# Altium project Placa_Base_ADA.PrjPcb
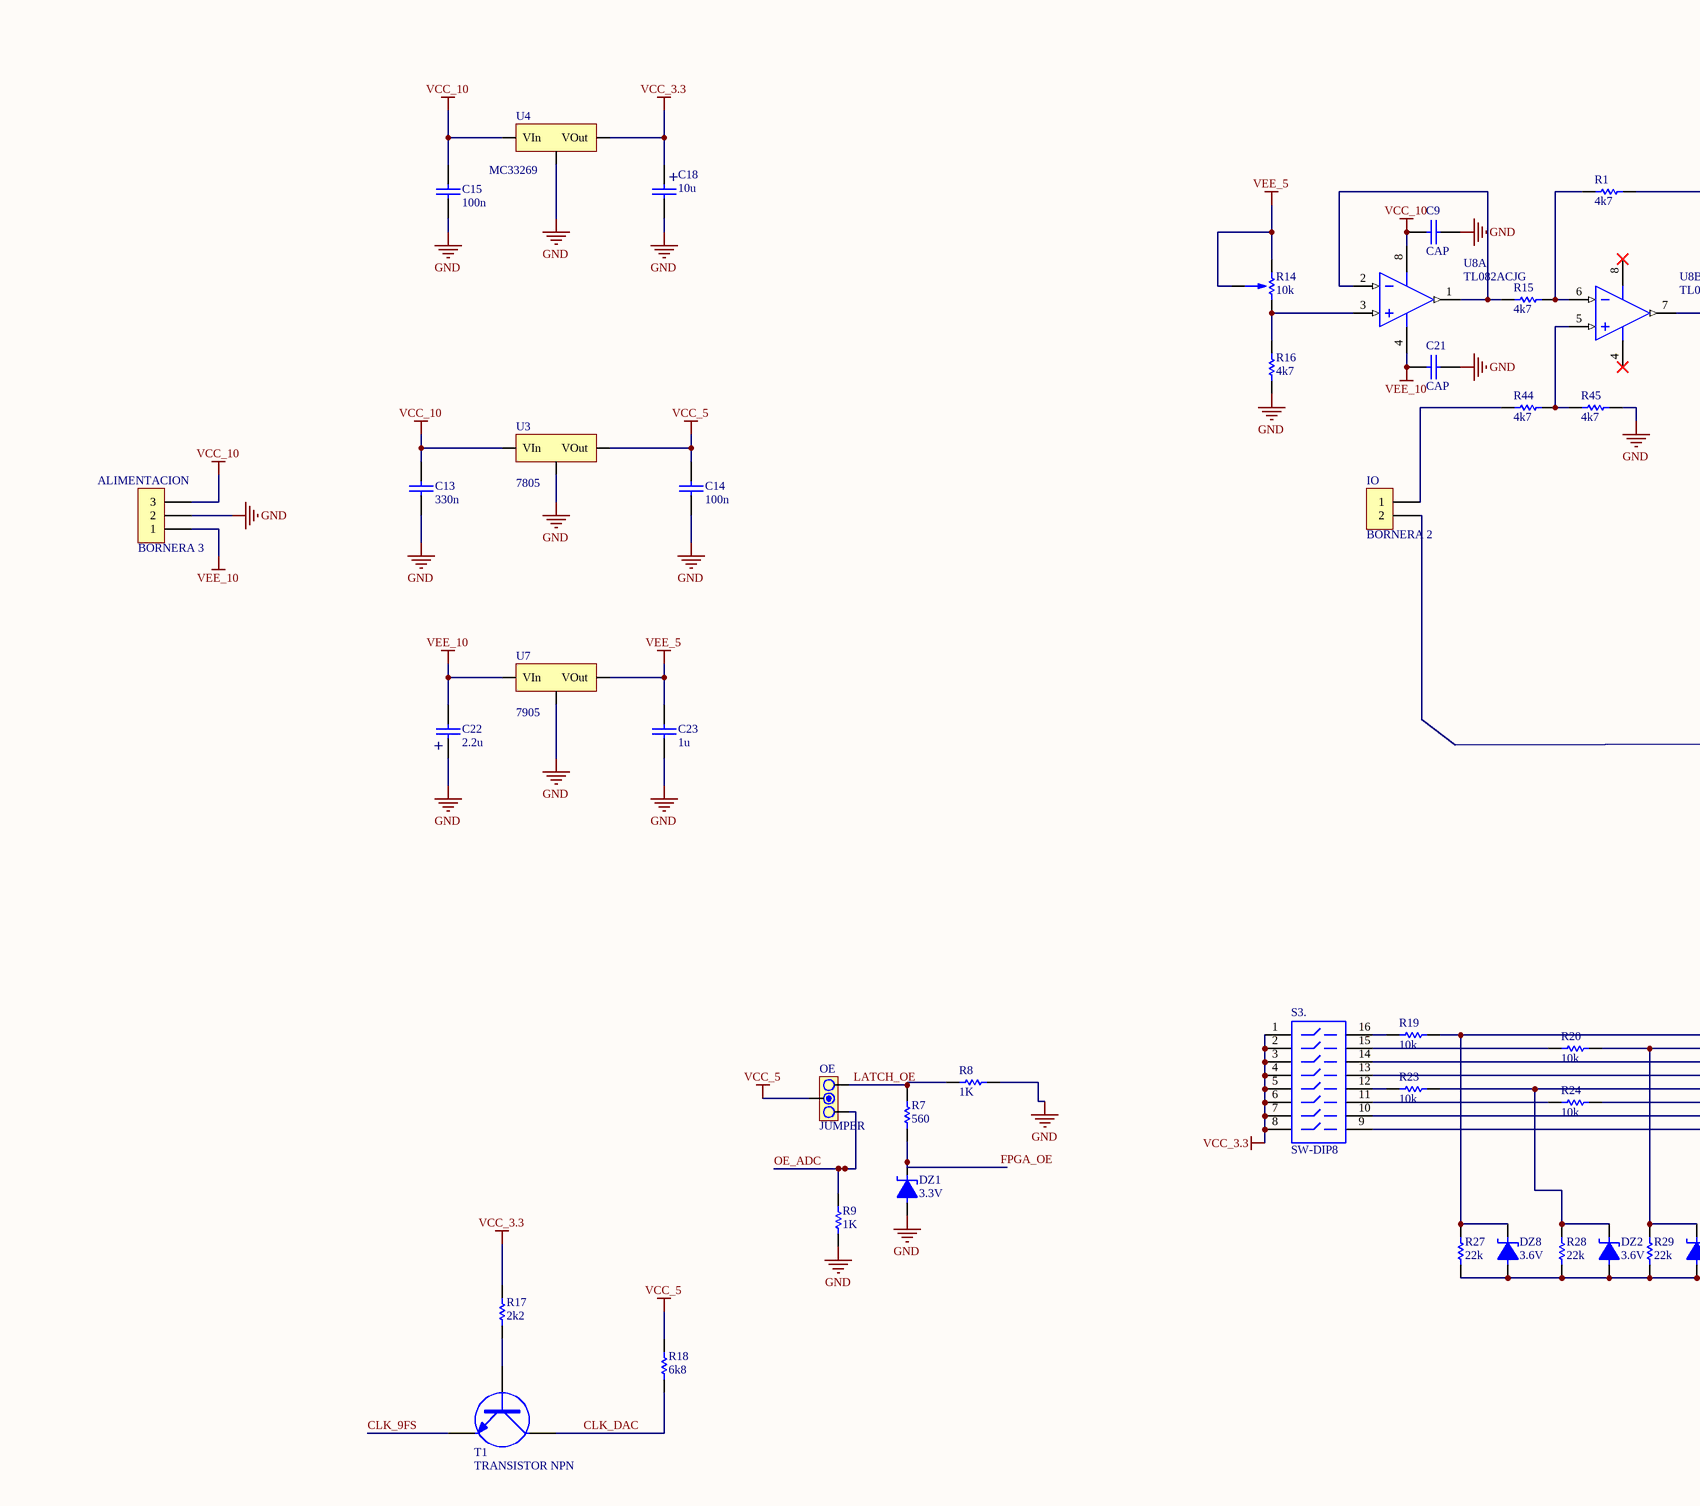
[diagram p0: Placa_Base.SchDoc, top left]
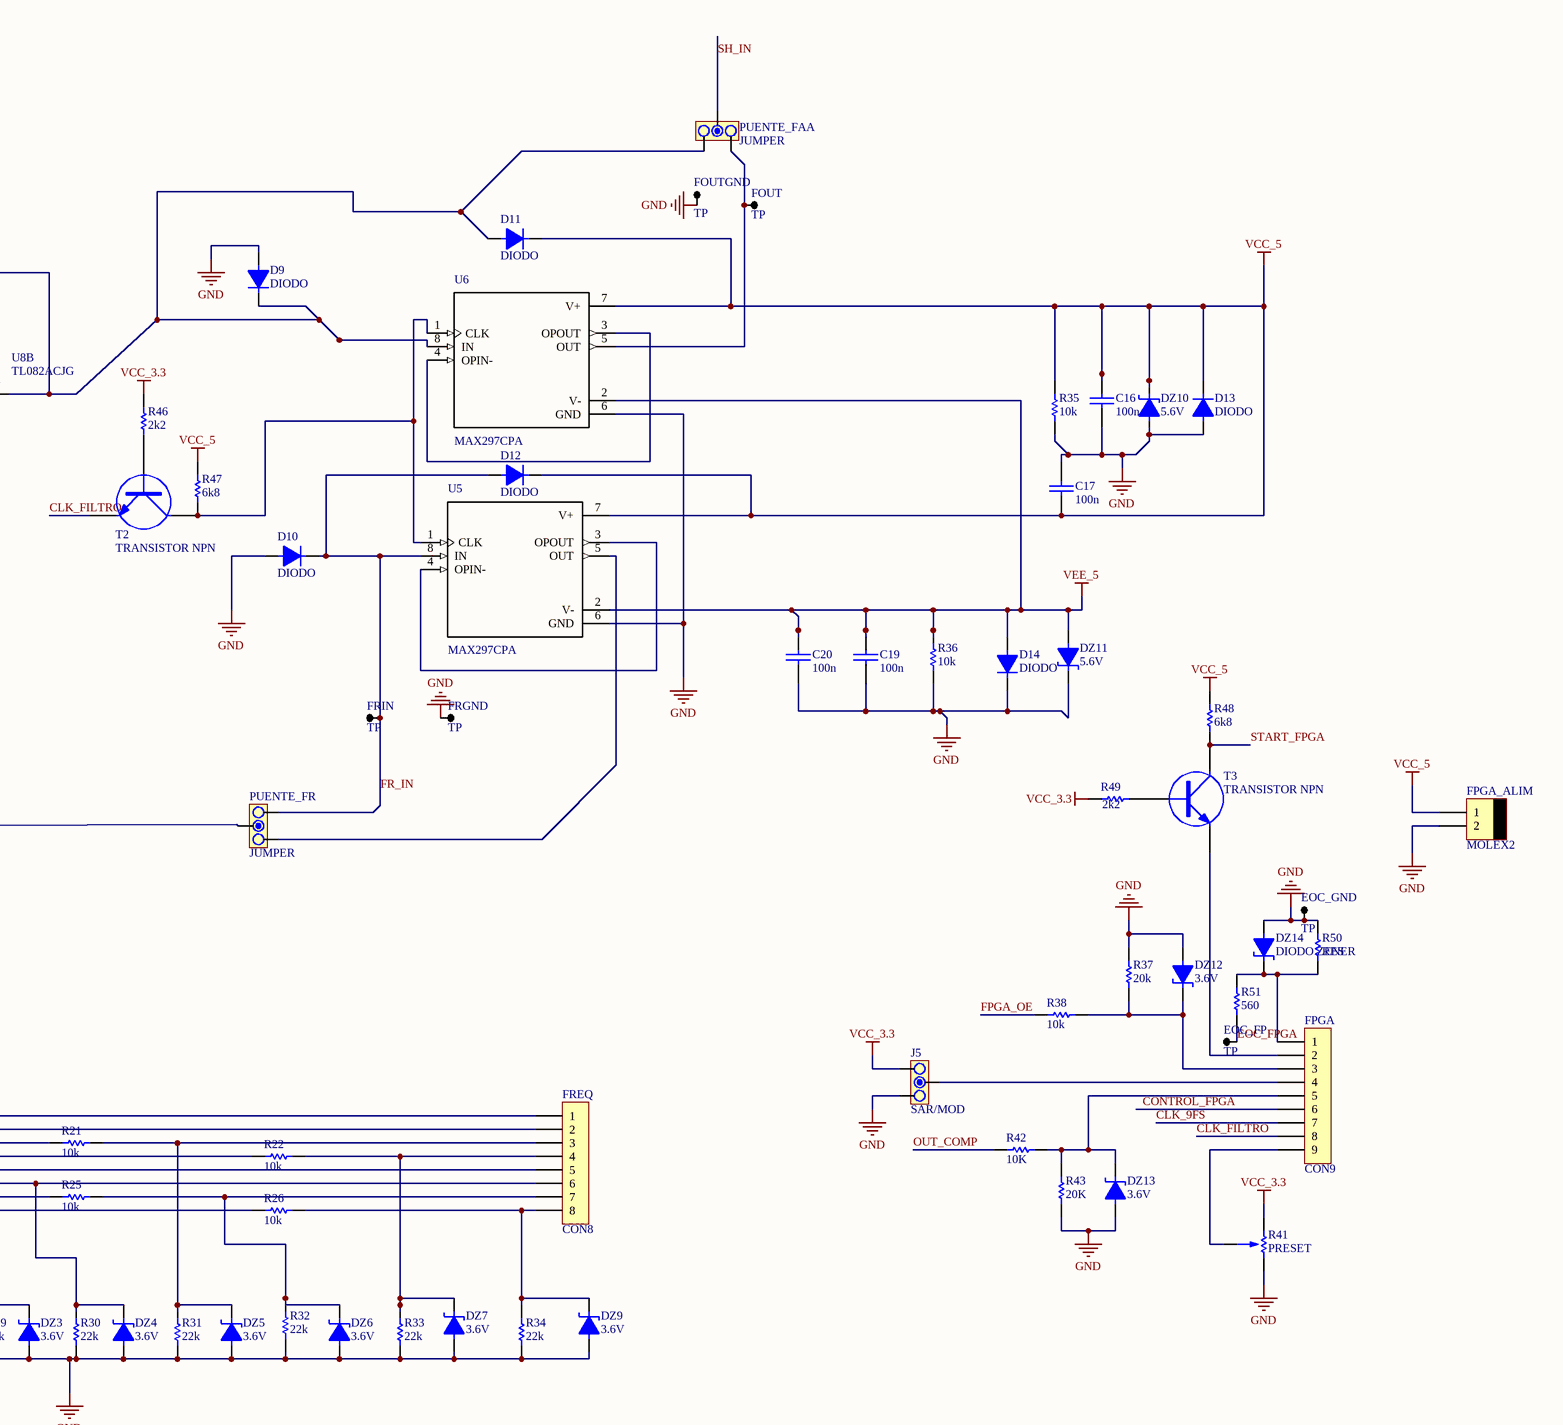
[diagram p1: Placa_Base.SchDoc, top right]
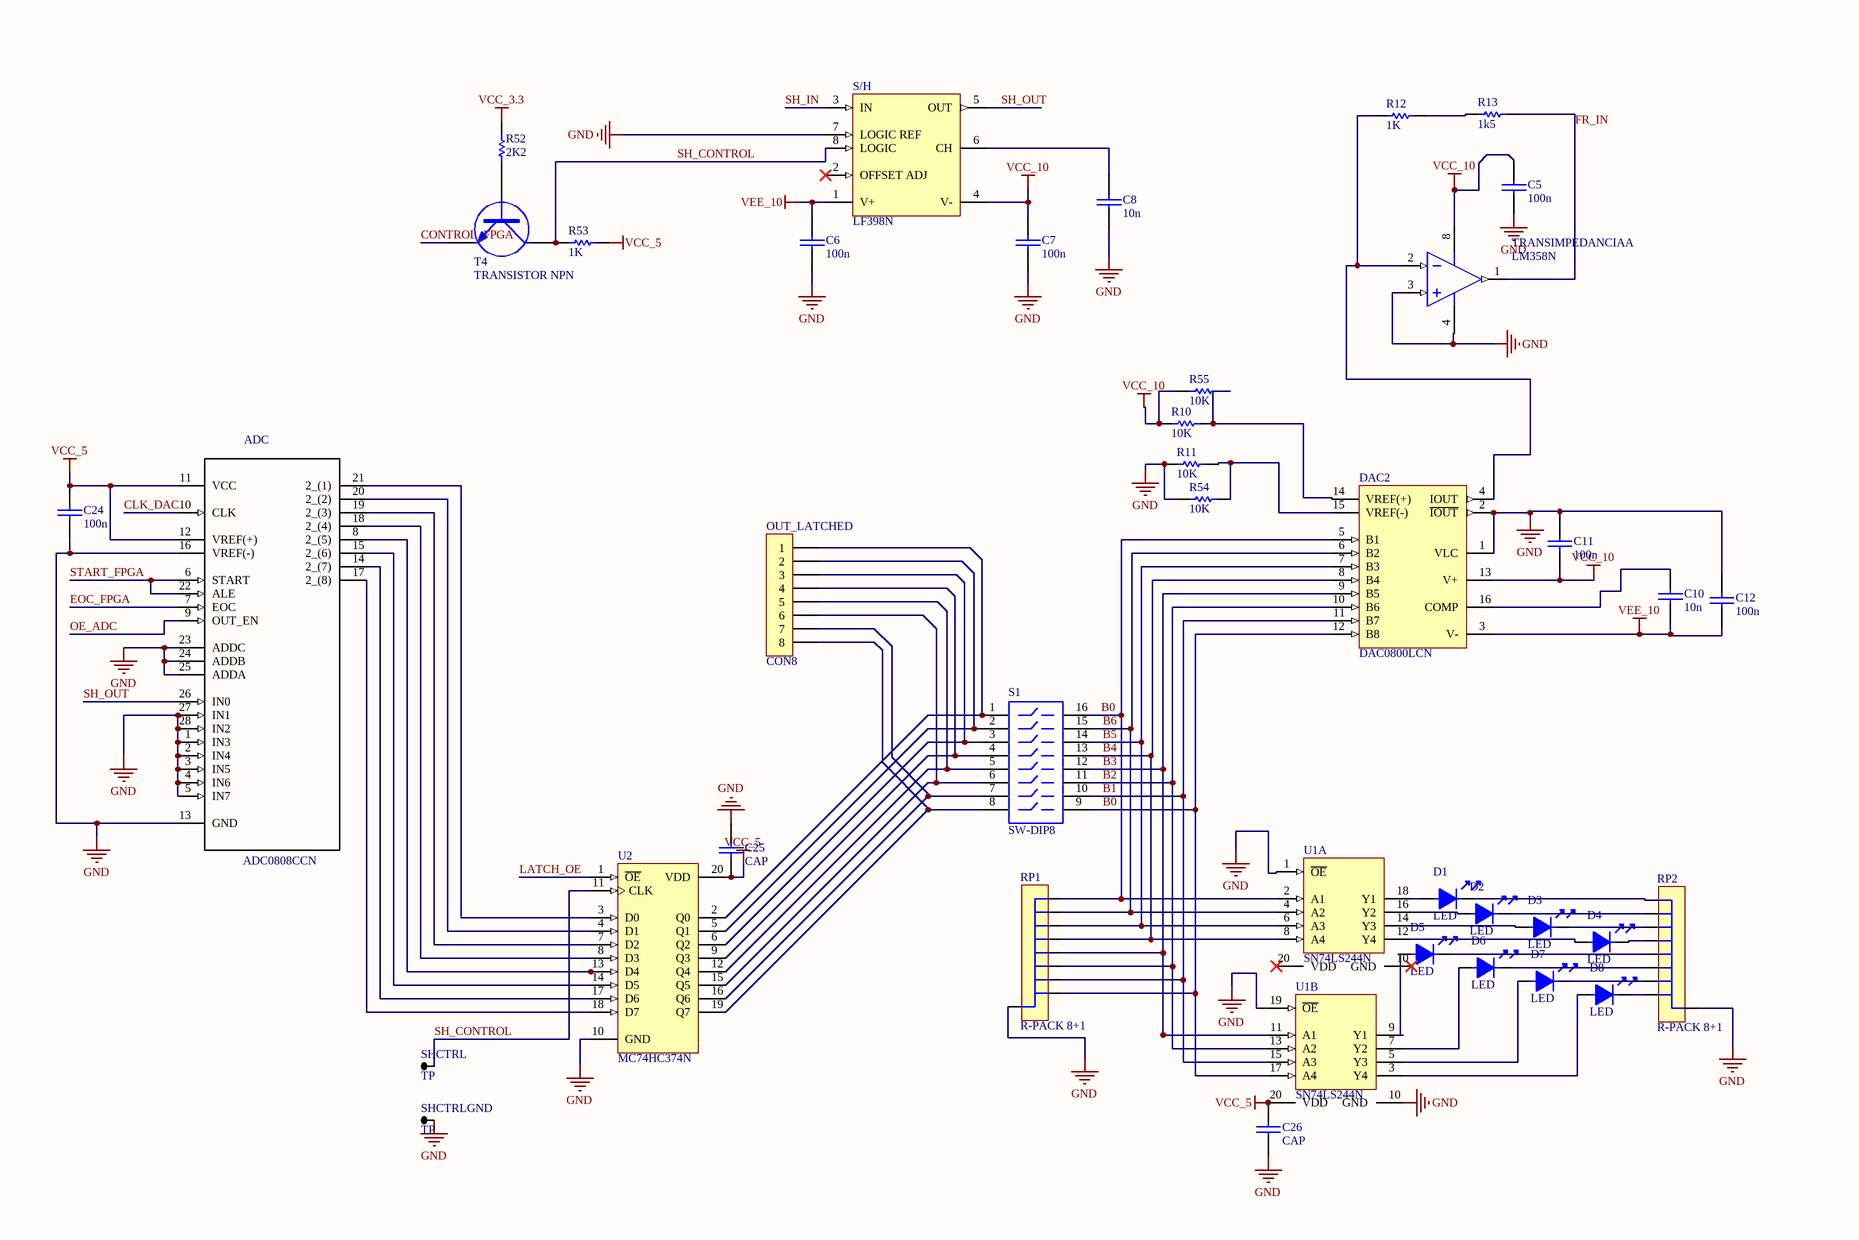
[diagram p2: Placa_Base.SchDoc, bottom left]
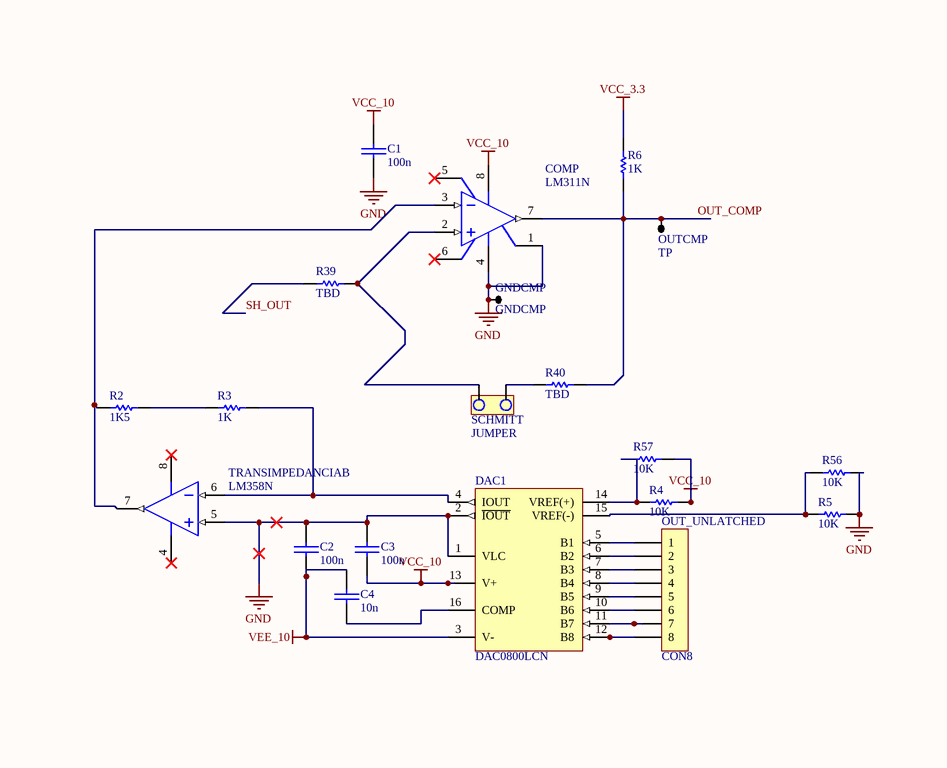
[diagram p3: Placa_Base.SchDoc, bottom right]
1 sheet, 155 parts. Net scope: global (net labels, ports and power ports of the same name join across sheets).
Board file: PCB5.PcbDoc

## Sheet Placa_Base.SchDoc
size A0

### Parts
ADC  ADC0808CCN  [DIP28]
ALIMENTACION  BORNERA 3  [BORNERA3]
C1  100n  [CAP200]
C2  100n  [CAP200]
C3  100n  [CAP200]
C4  10n  [CAP200]
C5  100n  [CAP200]
C6  100n  [CAP200]
C7  100n  [CAP200]
C8  10n  [CAP200]
C9  CAP  [CAP200]
C10  10n  [CAP200]
C11  100n  [CAP200]
C12  100n  [CAP200]
C13  330n  [CAP200]
C14  100n  [CAP200]
C15  100n  [CAP200]
C16  100n  [CAP200]
C17  100n  [CAP200]
C18  10u  [CAP100RP]
C19  100n  [CAP200]
C20  100n  [CAP200]
C21  CAP  [CAP200]
C22  2.2u  [CAP100RP]
C23  1u  [CAP200]
C24  100n  [CAP200]
C25  CAP  [CAP200]
C26  CAP  [CAP200]
COMP  LM311N  [N08E]
D1  LED  [LED3]
D2  LED  [LED3]
D3  LED  [LED3]
D4  LED  [LED3]
D5  LED  [LED3]
D6  LED  [LED3]
D7  LED  [LED3]
D8  LED  [LED3]
D9  DIODO  [DO41]
D10  DIODO  [DO41]
D11  DIODO  [DO41]
D12  DIODO  [DO41]
D13  DIODO  [DO41]
D14  DIODO  [DO41]
DAC1  DAC0800LCN  [N16E]
DAC2  DAC0800LCN  [N16E]
DZ1  3.3V  [DO41]
DZ2  3.6V  [DO41]
DZ3  3.6V  [DO41]
DZ4  3.6V  [DO41]
DZ5  3.6V  [DO41]
DZ6  3.6V  [DO41]
DZ7  3.6V  [DO41]
DZ8  3.6V  [DO41]
DZ9  3.6V  [DO41]
DZ10  5.6V  [DO41]
DZ11  5.6V  [DO41]
DZ12  3.6V  [DO41]
DZ13  3.6V  [DO41]
DZ14  DIODO ZENER  [DO41]
EOC_FP  TP  [TPTH]
EOC_GND  TP  [TPTH]
FOUT  TP  [TPTH]
FOUTGND  TP  [TPTH]
FPGA  CON9  [SIP9]
FPGA_ALIM  MOLEX2  [MOLEX2]
FREQ  CON8  [SIP8]
FRGND  TP  [TPTH]
FRIN  TP  [TPTH]
GNDCMP  GNDCMP  [TPTH]
IO  BORNERA 2  [BORNERA2]
J5  SAR/MOD  [JUMPER3]
OE  JUMPER  [JUMPER3]
OUT_LATCHED  CON8  [SIP8]
OUT_UNLATCHED  CON8  [SIP8]
OUTCMP  TP  [TPTH]
PUENTE_FAA  JUMPER  [JUMPER3]
PUENTE_FR  JUMPER  [JUMPER3]
R1  4k7  [RES400]
R2  1K5  [RES400]
R3  1K  [RES400]
R4  10K  [RES400]
R5  10K  [RES400]
R6  1K  [RES400]
R7  560  [RES400]
R8  1K  [RES400]
R9  1K  [RES400]
R10  10K  [RES400]
R11  10K  [RES400]
R12  1K  [RES400]
R13  1k5  [RES400]
R14  10k  [PRESET V]
R15  4k7  [RES400]
R16  4k7  [RES400]
R17  2k2  [RES400]
R18  6k8  [RES400]
R19  10k  [RES400]
R20  10k  [RES400]
R21  10k  [RES400]
R22  10k  [RES400]
R23  10k  [RES400]
R24  10k  [RES400]
R25  10k  [RES400]
R26  10k  [RES400]
R27  22k  [RES400]
R28  22k  [RES400]
R29  22k  [RES400]
R30  22k  [RES400]
R31  22k  [RES400]
R32  22k  [RES400]
R33  22k  [RES400]
R34  22k  [RES400]
R35  10k  [RES400]
R36  10k  [RES400]
R37  20k  [RES400]
R38  10k  [RES400]
R39  TBD  [RES400]
R40  TBD  [RES400]
R41  PRESET  [PRESET V]
R42  10K  [RES400]
R43  20K  [RES400]
R44  4k7  [RES400]
R45  4k7  [RES400]
R46  2k2  [RES400]
R47  6k8  [RES400]
R48  6k8  [RES400]
R49  2k2  [RES400]
R50  RES  [RES400]
R51  560  [RES400]
R52  2K2  [RES400]
R53  1K  [RES400]
R54  10K  [RES400]
R55  10K  [RES400]
R56  10K  [RES400]
R57  10K  [RES400]
RP1  R-PACK 8+1  [RESNET8+1]
RP2  R-PACK 8+1  [RESNET8+1]
S1  SW-DIP8  [DIP-16-KEY]
S3.  SW-DIP8  [DIP-16-KEY]
S/H  LF398N  [N08E]
SCHMITT  JUMPER  [JUMPER2]
SHCTRL  TP  [TPTH]
SHCTRLGND  TP  [TPTH]
T1  TRANSISTOR NPN  [TO92]
T2  TRANSISTOR NPN  [TO92]
T3  TRANSISTOR NPN  [TO92]
T4  TRANSISTOR NPN  [TO92]
TRANSIMPEDANCIA  LM358N  [N08E]  (parts A,B of 2)
U1  SN74LS244N  [738-03]  (parts A,B of 2)
U2  MC74HC374N  [738-03]
U3  7805  [TO-220 V]
U4  MC33269  [TO-220 V]
U5  MAX297CPA  [DIP8]
U6  MAX297CPA  [DIP8]
U7  7905  [TO-220 V]
U8  TL082ACJG  [693-02]  (parts A,B of 2)

### Nets
GND: ADC.1(IN3) ADC.2(IN4) ADC.3(IN5) ADC.4(IN6) ADC.5(IN7) ADC.13(GND) ADC.16(VREF(-)) ADC.23(ADDC) ADC.24(ADDB) ADC.25(ADDA) ADC.27(IN1) ADC.28(IN2) ALIMENTACION.2 C1.2 C2.1 C3.1 C5.2 C6.2 C7.2 C8.2 C9.2 C11.1 C12.1 C13.2 C14.2 C15.2 C16.2 C17.1 C18.2 C19.2 C20.2 C21.2 C22.1 C23.2 C24.2 C25.1 C26.2 COMP.1(GND) COMP.4(V-) D9.1 D10.1 D13.1 D14.2 DAC1.1(VLC) DAC1.2(~{IOUT}) DAC2.1(VLC) DAC2.2(~{IOUT}) DZ1.1 DZ2.1 DZ3.1 DZ4.1 DZ5.1 DZ6.1 DZ7.1 DZ8.1 DZ9.1 DZ10.1 DZ11.2 DZ12.1 DZ13.1 DZ14.1 EOC_GND.1 FOUTGND.1 FPGA_ALIM.2 FRGND.1 GNDCMP.1 J5.1 R5.2 R8.1 R9.1 R11.1 R16.2 R27.1 R28.1 R29.1 R30.1 R31.1 R32.1 R33.1 R34.1 R35.1 R36.1 R37.2 R41.1 R43.1 R45.2 R50.2 R54.1 R56.2 RP1.1 RP2.1 S/H.7(LOGIC_REF) SHCTRLGND.1 TRANSIMPEDANCIA.3(INA+) TRANSIMPEDANCIA.4(GND) TRANSIMPEDANCIA.5(INB+) U1.1(~{OE}) U1.10(GND) U1.19(~{OE}) U2.10(GND) U3.2(GND) U4.2(GND) U5.6(GND) U6.6(GND) U7.1(GND)
VCC_3.3: C18.1 J5.3 R6.2 R17.2 R41.3 R46.2 R49.1 R52.1 S3..1 S3..2 S3..3 S3..4 S3..5 S3..6 S3..7 S3..8 U4.3(VOut)
VCC_5: ADC.11(VCC) ADC.12(VREF(+)) C14.1 C16.1 C17.2 C24.1 C25.2 C26.1 D11.2 D12.2 D13.2 DZ10.2 FPGA_ALIM.1 OE.2 R18.2 R35.2 R47.1 R48.1 R53.1 U1.20(VDD) U2.20(VDD) U3.3(VOut) U5.7(V+) U6.7(V+)  [also labelled VDD]
VCC_10: ALIMENTACION.3 C1.1 C3.2 C5.1 C7.1 C9.1 C11.2 C13.1 C15.1 COMP.8(V+) DAC1.13(V+) DAC2.13(V+) R4.2 R10.1 R55.1 R57.2 S/H.4(V-) TRANSIMPEDANCIA.8(V+) U3.1(VIn) U4.1(VIn) U8.8(V+)
VEE_5: C19.1 C20.1 C23.1 D14.1 DZ11.1 R14.2 R14.3 R36.2 U5.2(V-) U6.2(V-) U7.3(VOut)
VEE_10: ALIMENTACION.1 C2.2 C4.1 C6.1 C10.2 C12.2 C21.1 C22.2 DAC1.3(V-) DAC2.3(V-) S/H.1(V+) U7.2(VIn) U8.4(V-)
B0: DAC2.5(B1) DAC2.12(B8) RP1.2 RP1.9 S1.9 S1.16 U1.2(A1) U1.17(A4)
B1: DAC2.11(B7) RP1.3 S1.10 U1.15(A3)
B2: DAC2.10(B6) RP1.4 S1.11 U1.13(A2)
B3: DAC2.9(B5) RP1.5 S1.12 U1.11(A1)
B4: DAC2.8(B4) RP1.6 S1.13 U1.8(A4)
B5: DAC2.7(B3) RP1.7 S1.14 U1.6(A3)
B6: DAC2.6(B2) RP1.8 S1.15 U1.4(A2)
CLK_9FS: FPGA.7 T1.3(E)
CLK_DAC: ADC.10(CLK) R18.1 T1.2(C)
CLK_FILTRO: FPGA.8 T2.3(E)
CONTROL_FPGA: FPGA.6 T4.3(E)
EOC_FPGA: ADC.7(EOC) EOC_FP.1 R51.1
FPGA_OE: DZ1.2 R7.1 R38.1
FR_IN: D10.2 D12.1 FRIN.1 PUENTE_FR.1 R13.2 TRANSIMPEDANCIA.1(OUTA) U5.8(IN)
LATCH_OE: OE.3 R7.2 R8.2 U2.1(~{OE})
OE_ADC: ADC.9(OUT_EN) OE.1 R9.2
OUT_COMP: COMP.7(OUT) OUTCMP.1 R6.1 R40.2 R42.1
SH_CONTROL: R53.2 S/H.8(LOGIC) SHCTRL.1 T4.2(C) U2.11(CLK)
SH_IN: PUENTE_FAA.2 S/H.3(IN)
SH_OUT: ADC.26(IN0) R39.1 S/H.5(OUT)
START_FPGA: ADC.6(START) ADC.22(ALE) R48.2 T3.2(C)
NetADC_8: ADC.8(2_(5)) U2.13(D4)
NetADC_14: ADC.14(2_(7)) U2.17(D6)
NetADC_15: ADC.15(2_(6)) U2.14(D5)
NetADC_17: ADC.17(2_(8)) U2.18(D7)
NetADC_18: ADC.18(2_(4)) U2.8(D3)
NetADC_19: ADC.19(2_(3)) U2.7(D2)
NetADC_20: ADC.20(2_(2)) U2.4(D1)
NetADC_21: ADC.21(2_(1)) U2.3(D0)
NetC4_2: C4.2 DAC1.16(COMP)
NetC8_1: C8.1 S/H.6(CH)
NetC10_1: C10.1 DAC2.16(COMP)
NetCOMP_2: COMP.2(IN+) R39.2 SCHMITT.1
NetCOMP_3: COMP.3(IN-) R2.1 TRANSIMPEDANCIA.7(OUTB)
NetD1_1: D1.1 U1.18(Y1)
NetD1_2: D1.2 RP2.9
NetD2_1: D2.1 U1.16(Y2)
NetD2_2: D2.2 RP2.8
NetD3_1: D3.1 U1.14(Y3)
NetD3_2: D3.2 RP2.7
NetD4_1: D4.1 U1.12(Y4)
NetD4_2: D4.2 RP2.6
NetD5_1: D5.1 U1.9(Y1)
NetD5_2: D5.2 RP2.5
NetD6_1: D6.1 U1.7(Y2)
NetD6_2: D6.2 RP2.4
NetD7_1: D7.1 U1.5(Y3)
NetD7_2: D7.2 RP2.3
NetD8_1: D8.1 U1.3(Y4)
NetD8_2: D8.2 RP2.2
NetD9_2: D9.2 D11.1 PUENTE_FAA.3 R1.2 U6.8(IN) U8.7(OUT)
NetDAC1_4: DAC1.4(IOUT) R3.2 TRANSIMPEDANCIA.6(INB-)
NetDAC1_5: DAC1.5(B1) OUT_UNLATCHED.1
NetDAC1_6: DAC1.6(B2) OUT_UNLATCHED.2
NetDAC1_7: DAC1.7(B3) OUT_UNLATCHED.3
NetDAC1_8: DAC1.8(B4) OUT_UNLATCHED.4
NetDAC1_9: DAC1.9(B5) OUT_UNLATCHED.5
NetDAC1_10: DAC1.10(B6) OUT_UNLATCHED.6
NetDAC1_11: DAC1.11(B7) OUT_UNLATCHED.7
NetDAC1_12: DAC1.12(B8) OUT_UNLATCHED.8
NetDAC1_14: DAC1.14(VREF(+)) R4.1 R57.1
NetDAC1_15: DAC1.15(VREF(-)) R5.1 R56.1
NetDAC2_4: DAC2.4(IOUT) R12.1 TRANSIMPEDANCIA.2(INA-)
NetDAC2_14: DAC2.14(VREF(+)) R10.2 R55.2
NetDAC2_15: DAC2.15(VREF(-)) R11.2 R54.2
NetDZ2_2: DZ2.2 FREQ.5 R23.2 R28.2
NetDZ3_2: DZ3.2 FREQ.2 R20.2 R29.2
NetDZ4_2: DZ4.2 FREQ.6 R24.2 R30.2
NetDZ5_2: DZ5.2 FREQ.3 R21.2 R31.2
NetDZ6_2: DZ6.2 FREQ.7 R25.2 R32.2
NetDZ7_2: DZ7.2 FREQ.4 R22.2 R33.2
NetDZ8_2: DZ8.2 FREQ.1 R19.2 R27.2
NetDZ9_2: DZ9.2 FREQ.8 R26.2 R34.2
NetDZ12_2: DZ12.2 FPGA.3 R37.1 R38.2
NetDZ13_2: DZ13.2 FPGA.5 R42.2 R43.2
NetDZ14_2: DZ14.2 FPGA.1 R50.1 R51.2
NetFOUT_1: FOUT.1 PUENTE_FAA.1 U6.5(OUT)
NetFPGA_2: FPGA.2 T3.3(E)
NetFPGA_4: FPGA.4 J5.2
NetFPGA_9: FPGA.9 R41.2
NetIO_1: IO.1 R44.1
NetIO_2: IO.2 PUENTE_FR.2
NetOUT_LATCHED_1: OUT_LATCHED.1 S1.1 U2.2(Q0)
NetOUT_LATCHED_2: OUT_LATCHED.2 S1.2 U2.5(Q1)
NetOUT_LATCHED_3: OUT_LATCHED.3 S1.3 U2.6(Q2)
NetOUT_LATCHED_4: OUT_LATCHED.4 S1.4 U2.9(Q3)
NetOUT_LATCHED_5: OUT_LATCHED.5 S1.5 U2.12(Q4)
NetOUT_LATCHED_6: OUT_LATCHED.6 S1.6 U2.15(Q5)
NetOUT_LATCHED_7: OUT_LATCHED.7 S1.7 U2.16(Q6)
NetOUT_LATCHED_8: OUT_LATCHED.8 S1.8 U2.19(Q7)
NetPUENTE_FR_3: PUENTE_FR.3 U5.5(OUT)
NetR1_1: R1.1 R15.2 U8.6(IN-)
NetR2_2: R2.2 R3.1
NetR12_2: R12.2 R13.1
NetR14_1: R14.1 R16.1 U8.3(IN+)
NetR15_1: R15.1 U8.1(OUT) U8.2(IN-)
NetR17_1: R17.1 T1.1(B)
NetR19_1: R19.1 S3..16
NetR20_1: R20.1 S3..15
NetR21_1: R21.1 S3..14
NetR22_1: R22.1 S3..13
NetR23_1: R23.1 S3..12
NetR24_1: R24.1 S3..11
NetR25_1: R25.1 S3..10
NetR26_1: R26.1 S3..9
NetR40_1: R40.1 SCHMITT.2
NetR44_2: R44.2 R45.1 U8.5(IN+)
NetR46_1: R46.1 T2.1(B)
NetR47_2: R47.2 T2.2(C) U5.1(CLK) U6.1(CLK)
NetR49_2: R49.2 T3.1(B)
NetR52_2: R52.2 T4.1(B)
NetU5_3: U5.3(OPOUT) U5.4(OPIN-)
NetU6_3: U6.3(OPOUT) U6.4(OPIN-)

Not connected (* = marked no-connect by the designer): COMP 5(BAL)* 6(BAL/STB)*; S/H 2(OFFSET_ADJ)*

### Notes on the sheet
- (in symbol CAPPOL) +

### Library data of the parts
ADC = ADC0808CCN: 28 pin 8-bit Microprocessor Compatible A/D Converters With 8-Channel Multiplexer 13 per tube; MF: Texas Instruments; MP: ADC0808CCN; Availability: Unavailable; SnapEDA_Link: https://www.snapeda.com/parts/ADC0808CCN/Texas%20Instruments/view-part/?ref=snap; Package: DIP-28 Texas Instruments; Price: None; Value: *
C1-C8 C10-C17 C19 C20 C23 C24 = CAP
C18 C22 = CAPPOL
COMP = LM311N: Voltage Comparator, 8-pin MDIP; Manufacturer: National Semiconductor; PackageTopMarking: NSUZXYTTE#*LM*311N; PowerWise: N; CompType: Amplifiers; Published: 4-Dec-2008; DatasheetVersion: Jan-2001; PackageVersion: revG, May-2006; PackageReference: N08E; Publisher: Altium Limited; PackageDescription: MDIP, .365 x .250 x .130in, 8 Lead, .100in Pitch; Supplier 1: Farnell; Supplier Part Number 1: 9487220; PartNumber: LM311N; RoHS: N; PinCount: 8; Code_JEDEC: MS-001-BA; ComponentLink1Description: LM311 Datasheet; ComponentLink1URL: http://www.national.com/ds/LM/LM311.pdf; ComponentLink2Description: LM311 Web Page; ComponentLink2URL: http://www.national.com/pf/LM/LM311.html; ComponentLink3Description: N08E Package Page; ComponentLink3URL: http://www.national.com/packaging/folders/n08e.html
DAC1 DAC2 = DAC0800LCN: 8-Bit D/A Converter, 16-pin MDIP; Manufacturer: National Semiconductor; PackageTopMarking: NSUZXYYTTE#*DAC0800LCN*DAC-08EP; PowerWise: N; Published: 4-Dec-2008; DatasheetVersion: Sep-2006; PackageVersion: revG, May-2006; PackageReference: N16E; Publisher: Altium Limited; PackageDescription: MDIP, .750 x .250 x .130in, 16 Lead, .100in Pitch; Supplier 1: Farnell; Supplier Part Number 1: 9486640; PartNumber: DAC0800LCN; RoHS: N; PinCount: 16; CompType: D/A Converter; Code_JEDEC: MS-001-BB; ComponentLink1Description: DAC0800 Datasheet; ComponentLink1URL: http://www.national.com/ds/DA/DAC0800.pdf; ComponentLink2Description: DAC0800 Web Page; ComponentLink2URL: http://www.national.com/pf/DA/DAC0800.html; ComponentLink3Description: N16E Package Page; ComponentLink3URL: http://www.national.com/packaging/folders/n16e.html
DZ1-DZ13 = DIODO ZENER
GNDCMP = TP
J5 OE PUENTE_FAA PUENTE_FR = JUMPER3
R1-R13 R15-R40 R42-R49 R51-R57 = RES
R14 = PRESET
S1 S3. = SW-DIP8: 4009 Series DIP Switch, Raised actuator; Published: 24-Mar-1999; LatestRevisionDate: 17-Dec-2003; LatestRevisionNote: PCB Footprint replaced.; PackageReference: DIP-16-KEY; Publisher: Altium Limited; PackageDescription: DIP; 16 Leads; Row Spacing 7.62 mm; Pitch 2.54 mm; ComponentLink1Description: Manufacturer Link; ComponentLink1URL: http://www.oupiin.com/prodindx.html#Headers
S/H = LF398N: Monolithic Sample and Hold Circuits, 8-pin MDIP; Manufacturer: National Semiconductor; PackageTopMarking: NSUZXYTTE#*LF*398N; PowerWise: N; CompType: Analog IC; Published: 4-Dec-2008; DatasheetVersion: Jul-2000; PackageVersion: revG, May-2006; PackageReference: N08E; Publisher: Altium Limited; PackageDescription: MDIP, .365 x .250 x .130in, 8 Lead, .100in Pitch; Supplier 1: Farnell; Supplier Part Number 1: 9487140; PartNumber: LF398N; RoHS: N; PinCount: 8; Code_JEDEC: MS-001-BA; ComponentLink1Description: LF398 Datasheet; ComponentLink1URL: http://www.national.com/ds/LF/LF398.pdf; ComponentLink2Description: LF398 Web Page; ComponentLink2URL: http://www.national.com/pf/LF/LF398.html; ComponentLink3Description: N08E Package Page; ComponentLink3URL: http://www.national.com/packaging/folders/n08e.html
TRANSIMPEDANCIA = LM358N: Low Power Dual Operational Amplifier, 8-pin MDIP; Manufacturer: National Semiconductor; PackageTopMarking: NSUZXYTTE#*LM*358N; PowerWise: N; CompType: Amplifiers; Published: 4-Dec-2008; LatestRevisionDate: 13-Jan-2009; LatestRevisionNote: Sim Model Added.; DatasheetVersion: Oct-2005; PackageVersion: revG, May-2006; PackageReference: N08E; Publisher: Altium Limited; PackageDescription: MDIP, .365 x .250 x .130in, 8 Lead, .100in Pitch; Supplier 1: Farnell; Supplier Part Number 1: 9486836; Supplier 2: Farnell; Supplier Part Number 2: 1523834; PartNumber: LM358N; RoHS: N; PinCount: 8; Code_JEDEC: MS-001-BA; ComponentLink1Description: LM358 Datasheet; ComponentLink1URL: http://www.national.com/ds/LM/LM358.pdf; ComponentLink2Description: LM358 Web Page; ComponentLink2URL: http://www.national.com/pf/LM/LM358.html; ComponentLink3Description: N08E Package Page; ComponentLink3URL: http://www.national.com/packaging/folders/n08e.html
U1 = SN74LS244N: Octal Buffer/Line Driver with 3-State Outputs; Published: 15-Apr-2002; DatasheetVersion: Rev. 6, Dec-1999; PackageVersion: 1996; PackageReference: 738-03; Publisher: Altium Limited; PackageDescription: DIP; 20 Leads; Row Spacing 7.62 mm; Pitch 2.54 mm; Code_JEDEC: MS-001-AD; ComponentLink1Description: Manufacturer Link; ComponentLink1URL: http://www.onsemi.com/; ComponentLink2Description: Datasheet; ComponentLink2URL: http://www.onsemi.com/pub/Collateral/SN74LS240-D.PDF
U2 = MC74HC374N: Octal 3-State Non-Inverting D-Type Flip-Flop; Published: 17-Jul-2002; LatestRevisionDate: 06-Jun-2005; LatestRevisionNote: Stylized 3D Model Added; DatasheetVersion: 1989; PackageReference: 738-03; Publisher: Altium Limited; PackageDescription: DIP; 20 Leads; Row Spacing 7.62 mm; Pitch 2.54 mm; Code_JEDEC: MS-001-AD; ComponentLink1Description: Manufacturer Link; ComponentLink1URL: http://www.onsemi.com/site/products/parametrics/0,4446,238,00.html
U3 U4 = 78XX: REGULDOR POSITIVO
U5 U6 = MAX297CPA: Active Filter Single SW-CAP Low Pass 8th Order 50kHz 8-Pin PDIP N; MF: Maxim Integrated; MP: MAX297CPA+; SnapEDA_Link: https://www.snapeda.com/parts/MAX297CPA%2B/Maxim%20Integrated/view-part/?ref=snap; Availability: Unavailable; Price: None; Package: PDIP-8 Maxim; Value: *
U7 = 79XX: REGULADOR NEGATIVO
U8 = TL082ACJG: JFET-Input Operational Amplifier; Published: 17-Jul-2002; LatestRevisionDate: 06-Jun-2005; LatestRevisionNote: Stylized 3D Model Added.; DatasheetVersion: 1988; PackageReference: 693-02; Publisher: Altium Limited; PackageDescription: DIP; 8 Leads; Row Spacing 7.62 mm; Pitch 2.54 mm; Code_JEDEC: MO-001-AN; ComponentLink1Description: Manufacturer Link; ComponentLink1URL: http://www.onsemi.com/site/products/parametrics/0,4446,251,00.html